# EAGLE design UCSD_QuadCopter_Rev1 (EAGLE 7.1.0)
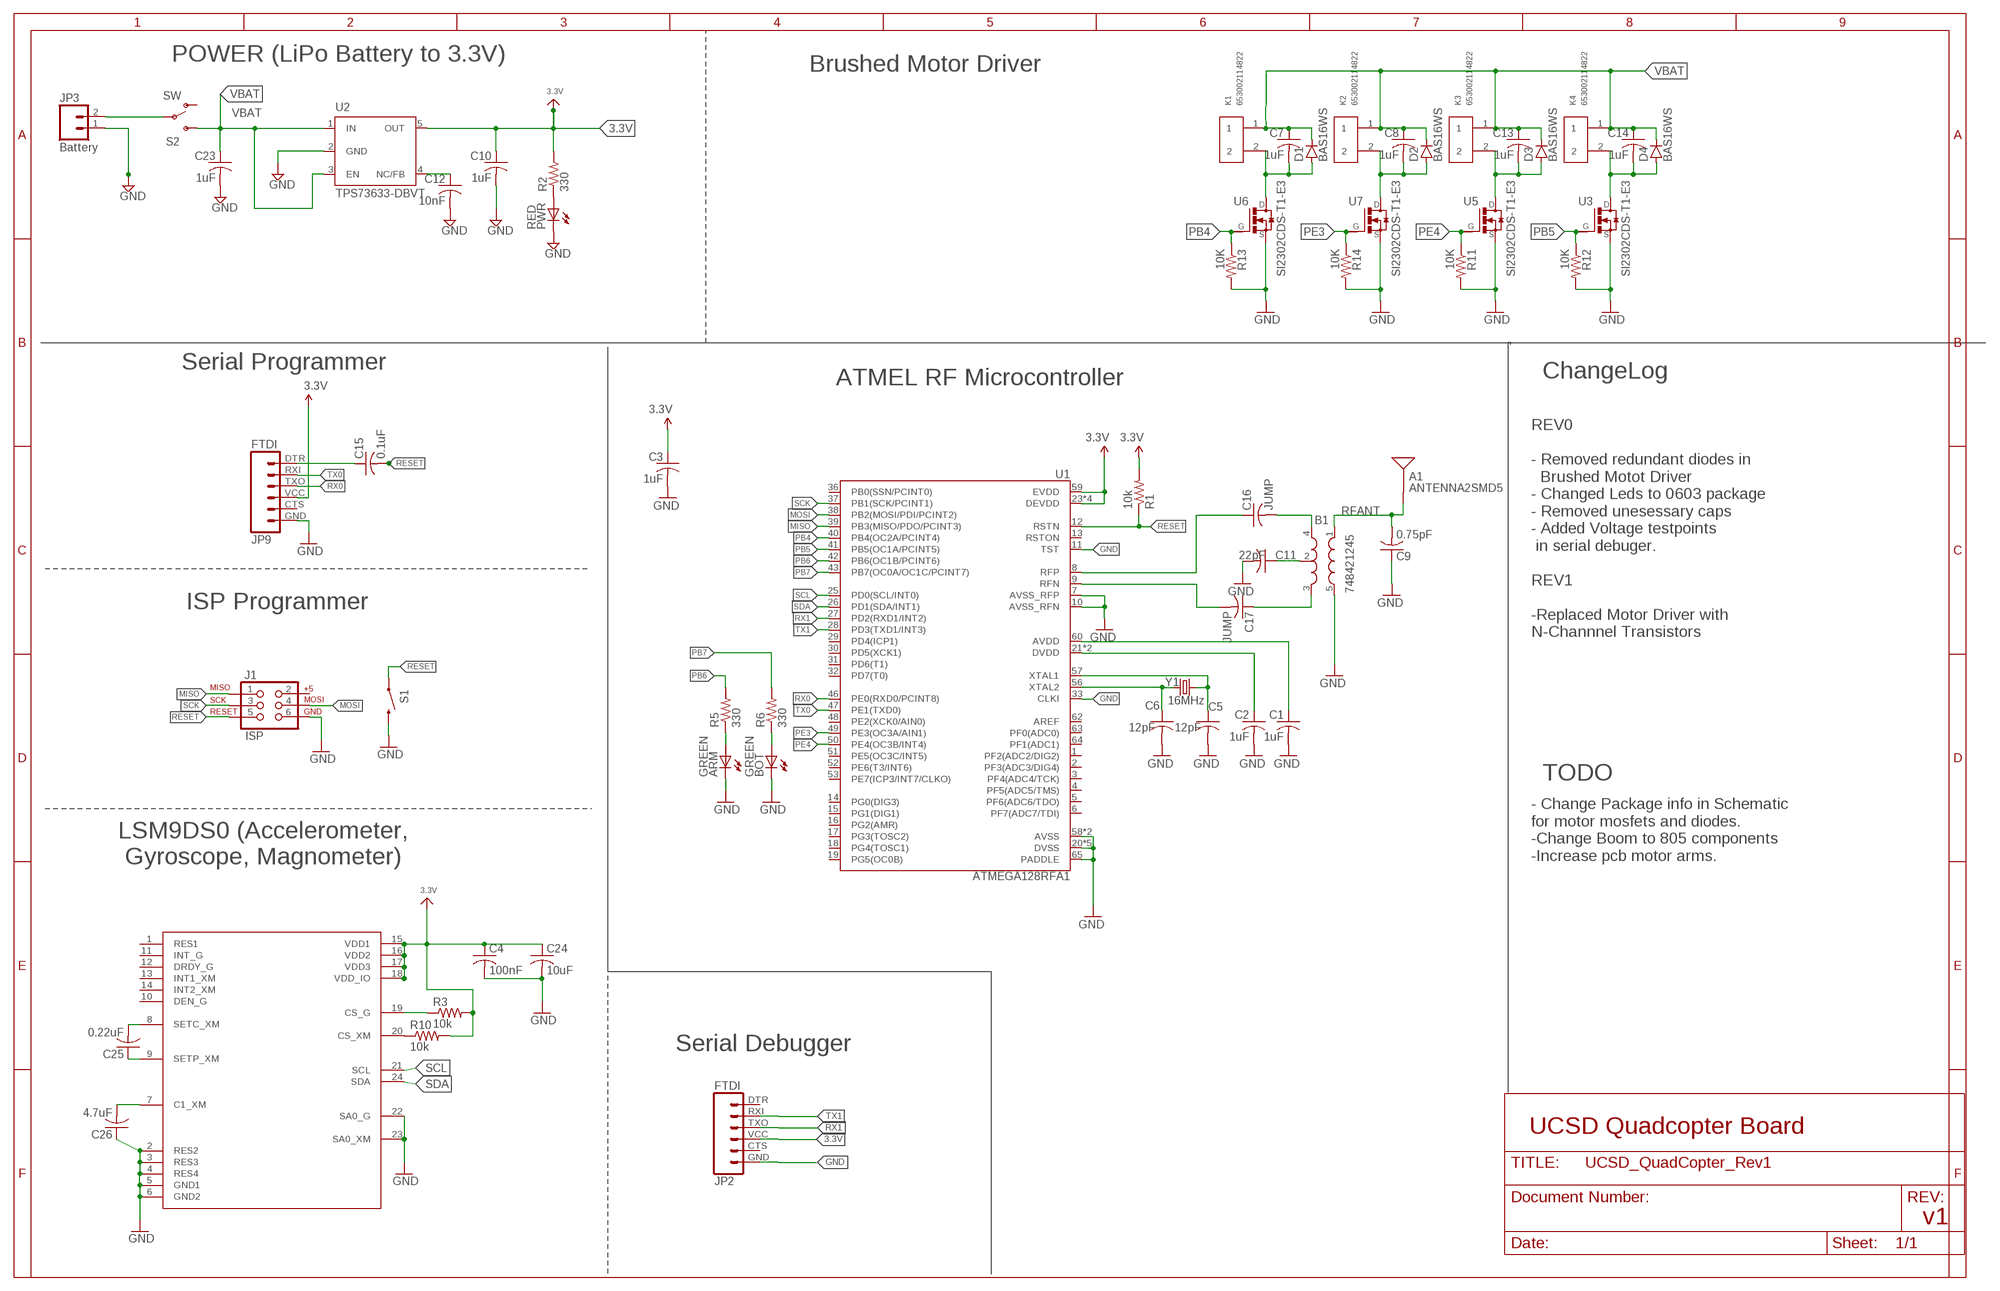
[diagram p0: schematic, sheet 1]

## Parts
A1  ANTENNA2SMD5  [ANTENNA-CHIP5]
ARM  GREEN  LEDCHIP-LED0805  [CHIP-LED0805]
B1  748421245  BALUN0805  [BALUN]
BOT  GREEN  LEDCHIP-LED0805  [CHIP-LED0805]
C1  1uF  C-USC0805  [C0805]
C2  1uF  C-USC0805  [C0805]
C3  1uF  C-USC0805  [C0805]
C4  100nF  C-USC0805  [C0805]
C5  12pF  C-USC0805  [C0805]
C6  12pF  C-USC0805  [C0805]
C7  1uF  C-USC0805  [C0805]
C8  1uF  C-USC0805  [C0805]
C9  0.75pF  C-USC0805  [C0805]
C10  1uF  C-USC0805  [C0805]
C11  22pF  C-USC0805  [C0805]
C12  10nF  C-USC0805  [C0805]
C13  1uF  C-USC0805  [C0805]
C14  1uF  C-USC0805  [C0805]
C15  0.1uF  C-USC0805  [C0805]
C16  JUMP  C-USC0805  [C0805]
C17  JUMP  C-USC0805  [C0805]
C23  1uF  C-USC0805  [C0805]
C24  10uF  C-USC0805  [C0805]
C25  0.22uF  C-USC0805  [C0805]
C26  4.7uF  C-USC0805  [C0805]
D1  BAS16WS  [SOD323_ST]
D2  BAS16WS  [SOD323_ST]
D3  BAS16WS  [SOD323_ST]
D4  BAS16WS  [SOD323_ST]
J1  ISP  AVR_SPI_PRG_6NS  [2X3-NS]
JP2  FTDI  FTDI_BASICPTH  [FTDI_BASIC]
JP3  Battery  M02PTH  [1X02]
JP9  FTDI  FTDI_BASICPTH  [FTDI_BASIC]
K1  653002114822  [653002114822]
K2  653002114822  [653002114822]
K3  653002114822  [653002114822]
K4  653002114822  [653002114822]
PWR  RED  LEDCHIP-LED0805  [CHIP-LED0805]
R1  10k  R-US_R0805  [R0805]
R2  330  R-US_R0805  [R0805]
R3  10k  R-US_R0805  [R0805]
R5  330  R-US_R0805  [R0805]
R6  330  R-US_R0805  [R0805]
R10  10k  R-US_R0805  [R0805]
R11  10K  R-US_R0805  [R0805]
R12  10K  R-US_R0805  [R0805]
R13  10K  R-US_R0805  [R0805]
R14  10K  R-US_R0805  [R0805]
S1  SWITCH-MOMENTARY-2SMD  [TACTILE_SWITCH_SMD]
S2  SW  SWITCH-SPDTPTH  [SWITCH-SPDT]
U1  ATMEGA128RFA1  [QFN-64]
U2  TPS73633-DBVT  [SOT23-DBV]
U3  SI2302CDS-T1-E3  [SOT95P237X112-3N]
U4  LSM9DS0  [LGA-24]
U5  SI2302CDS-T1-E3  [SOT95P237X112-3N]
U6  SI2302CDS-T1-E3  [SOT95P237X112-3N]
U7  SI2302CDS-T1-E3  [SOT95P237X112-3N]
Y1  16MHz  CRYSTAL5X3  [CRYSTAL-SMD-5X3]

## Nets
3.3V: C3.1 C4.1 C10.1 C24.1 JP2.VCC JP9.VCC R1.2 R2.2 R3.2 R10.2 U1.23(DEVDD) U1.34(DEVDD) U1.44(DEVDD) U1.54(DEVDD) U1.59(EVDD) U2.5(OUT) U4.15(VDD1) U4.16(VDD2) U4.17(VDD3) U4.18(VDD_IO)
AVDD: C1.1 U1.60(AVDD)
DTR: C15.1 JP9.DTR
DVDD: C2.1 U1.21(DVDD) U1.22(DVDD)
GND: ARM.C B1.5(GND) BOT.C C1.2 C2.2 C3.2 C4.2 C5.2 C6.2 C9.1 C10.2 C11.2 C12.2 C23.2 C24.2 C26.1 J1.6 JP2.GND JP3.1 JP9.GND PWR.C R11.2 R12.2 R13.2 R14.2 S1.3 U1.7(AVSS_RFP) U1.10(AVSS_RFN) U1.11(TST) U1.20(DVSS) U1.24(DVSS) U1.33(CLKI) U1.35(DVSS) U1.45(DVSS) U1.55(DVSS) U1.58(AVSS) U1.61(AVSS) U1.65(PADDLE) U2.2(GND) U3.2(S) U4.2(RES2) U4.3(RES3) U4.4(RES4) U4.5(GND1) U4.6(GND2) U4.22(SA0_G) U4.23(SA0_XM) U5.2(S) U6.2(S) U7.2(S)
MISO: J1.1 U1.39(PB3(MISO/PDO/PCINT3))
MOSI: J1.4 U1.38(PB2(MOSI/PDI/PCINT2))
N$1: C12.1 U2.4(NC/FB)
N$2: PWR.A R2.1
N$3: C5.1 U1.57(XTAL1) Y1.3
N$4: C6.1 U1.56(XTAL2) Y1.1
N$7: B1.2(GND) C11.1
N$8: ARM.A R5.1
N$10: B1.4(OUT1) C16.2
N$11: B1.3(OUT2) C17.1
N$13: BOT.A R6.1
N$15: JP3.2 S2.2(P)
N$20: C26.2 U4.7(C1_XM)
N$21: C25.2 U4.8(SETC_XM)
N$22: C25.1 U4.9(SETP_XM)
N$23: R3.1 U4.19(CS_G)
N$24: R10.1 U4.20(CS_XM)
N$29: C7.2 D1.A K1.2 U6.3(D)
N$30: C8.2 D2.A K2.2 U7.3(D)
N$31: C13.2 D3.A K3.2 U5.3(D)
N$32: C14.2 D4.A K4.2 U3.3(D)
PB4: R13.1 U1.40(PB4(OC2A/PCINT4)) U6.1(G)
PB5: R12.1 U1.41(PB5(OC1A/PCINT5)) U3.1(G)
PB6: R5.2 U1.42(PB6(OC1B/PCINT6))
PB7: R6.2 U1.43(PB7(OC0A/OC1C/PCINT7))
PE3: R14.1 U1.49(PE3(OC3A/AIN1)) U7.1(G)
PE4: R11.1 U1.50(PE4(OC3B/INT4)) U5.1(G)
RESET: C15.2 J1.5 R1.1 S1.1 U1.12(RSTN)
RFANT [RFSIG]: A1.FEED(SIGNAL) B1.1(IN) C9.2
RFN: C17.2 U1.9(RFN)
RFP: C16.1 U1.8(RFP)
RX0: JP9.TXO U1.46(PE0(RXD0/PCINT8))
RX1: JP2.TXO U1.27(PD2(RXD1/INT2))
SCK: J1.3 U1.37(PB1(SCK/PCINT1))
SCL: U1.25(PD0(SCL/INT0)) U4.21(SCL)
SDA: U1.26(PD1(SDA/INT1)) U4.24(SDA)
TX0: JP9.RXI U1.47(PE1(TXD0))
TX1: JP2.RXI U1.28(PD3(TXD1/INT3))
VBAT: C7.1 C8.1 C13.1 C14.1 C23.1 D1.C D2.C D3.C D4.C K1.1 K2.1 K3.1 K4.1 S2.3(S) U2.1(IN) U2.3(EN)
Unconnected: J1.2 JP2.CTS JP2.DTR JP9.CTS S2.1(O) U1.1(PF2(ADC2/DIG2)) U1.2(PF3(ADC3/DIG4)) U1.3(PF4(ADC4/TCK)) U1.4(PF5(ADC5/TMS)) U1.5(PF6(ADC6/TDO)) U1.6(PF7(ADC7/TDI)) U1.13(RSTON) U1.14(PG0(DIG3)) U1.15(PG1(DIG1)) U1.16(PG2(AMR)) U1.17(PG3(TOSC2)) U1.18(PG4(TOSC1)) U1.19(PG5(OC0B)) U1.29(PD4(ICP1)) U1.30(PD5(XCK1)) U1.31(PD6(T1)) U1.32(PD7(T0)) U1.36(PB0(SSN/PCINT0)) U1.48(PE2(XCK0/AIN0)) U1.51(PE5(OC3C/INT5)) U1.52(PE6(T3/INT6)) U1.53(PE7(ICP3/INT7/CLKO)) U1.62(AREF) U1.63(PF0(ADC0)) U1.64(PF1(ADC1)) U4.1(RES1) U4.10(DEN_G) U4.11(INT_G) U4.12(DRDY_G) U4.13(INT1_XM) U4.14(INT2_XM)

## Notes on the sheet
- POWER (LiPo Battery to 3.3V)
- Brushed Motor Driver
- Serial Programmer
- ATMEL RF Microcontroller | ChangeLog
- ISP Programmer
- REV0
  
  - Removed redundant diodes in 
    Brushed Motot Driver
  - Changed Leds to 0603 package
  - Removed unesessary caps
  - Added Voltage testpoints
   in serial debuger.
  
  REV1
  
  -Replaced Motor Driver with 
  N-Channnel Transistors
- TODO
- LSM9DS0 (Accelerometer,
   Gyroscope, Magnometer)
- - Change Package info in Schematic
  for motor mosfets and diodes.
  -Change Boom to 805 components
  -Increase pcb motor arms.
- Serial Debugger
- UCSD Quadcopter Board
- v1

## Library data of the parts
A1 = SparkFun-RF:ANTENNA2: Chip antenna Single endded antenna. Common with smaller chip antennas. CHIP4 package is the GPS Chip Antenna SKU: GPS-08418. CHIP5 package is 2.4GHz chip antenna SKU: WRL-00144.
ARM BOT PWR = led:LED: LED OSRAM: - CHIPLED LG R971, LG N971, LY N971, LG Q971, LY Q971, LO R971, LY R971 LH N974, LH R974 LS Q976, LO Q976, LY Q976 LO Q996 - Hyper CHIPLED LW Q18S LB Q993, LB Q99A, LB R99A - SideLED LS A670, LO A670, LY A670, LG A670, LP A670 LB A673, LV A673, LT A673, LW A673 LH A674 LY A675 LS A676, LA A676, LO A676, LY A676, LW A676 LS A679, LY A679, LG A679 - Hyper Micro SIDELED® LS Y876, LA Y876, LO Y876, LY Y876 LT Y87S - SmartLED LW L88C, LW L88S LB L89C, LB L89S, LG L890 LS L89K, LO L89K, LY L89K LS L896, LA L896, LO L896, LY L896 - TOPLED LS T670, LO T670, LY T670, LG T670, LP T670 LSG T670, LSP T670, LSY T670, LOP T670, LYG T670 LG T671, LOG T671, LSG T671 LB T673, LV T673, LT T673, LW T673 LH T674 LS T676, LA T676, LO T676, LY T676, LB T676, LH T676, LSB T676, LW T676 LB T67C, LV T67C, LT T67C, LS T67K, LO T67K, LY T67K, LW E67C LS E67B, LA E67B, LO E67B, LY E67B, LB E67C, LV E67C, LT E67C LW T67C LS T679, LY T679, LG T679 LS T770, LO T770, LY T770, LG T770, LP T770 LB T773, LV T773, LT T773, LW T773 LH T774 LS E675, LA E675, LY E675, LS T675 LS T776, LA T776, LO T776, LY T776, LB T776 LHGB T686 LT T68C, LB T68C - Hyper Mini TOPLED® LB M676 - Mini TOPLED Santana® LG M470 LS M47K, LO M47K, LY M47K Source: http://www.osram.convergy.de LUXEON: - LUMILED® LXK2-PW12-R00, LXK2-PW12-S00, LXK2-PW14-U00, LXK2-PW14-V00 LXK2-PM12-R00, LXK2-PM12-S00, LXK2-PM14-U00 LXK2-PE12-Q00, LXK2-PE12-R00, LXK2-PE12-S00, LXK2-PE14-T00, LXK2-PE14-U00 LXK2-PB12-K00, LXK2-PB12-L00, LXK2-PB12-M00, LXK2-PB14-N00, LXK2-PB14-P00, LXK2-PB14-Q00 LXK2-PR12-L00, LXK2-PR12-M00, LXK2-PR14-Q00, LXK2-PR14-R00 LXK2-PD12-Q00, LXK2-PD12-R00, LXK2-PD12-S00 LXK2-PH12-R00, LXK2-PH12-S00 LXK2-PL12-P00, LXK2-PL12-Q00, LXK2-PL12-R00 Source: www.luxeon.com KINGBRIGHT: KA-3528ASYC Source: www.kingbright.com
B1 = SparkFun-RF:BALUN: 0805 footprint balun- Ember 351/357
C1-C3 C5-C17 C23 = resistor:C-US: CAPACITOR, American symbol
C4 C24-C26 = rcl:C-US: CAPACITOR, American symbol
D1-D4 = Controller:BAS16WS: Small Signal Fast Switching Diode Source: Vishay Semiconductor, BAS16WS.pdf
J1 = Controller:AVR_SPI_PRG_6: AVR ISP 6 Pin This is the reduced ISP connector for AVR programming. Common on Arduino. This footprint will take up less PCB space and can be used with a 10-pin to 6-pin adapter such as SKU: BOB-08508
JP2 JP9 = SparkFun-Connectors:FTDI_BASIC: FTDI Basic header with labels
JP3 = SparkFun:M02: Header 2 Standard 2-pin 0.1" header. Use with straight break away headers (SKU : PRT-00116), right angle break away headers (PRT-00553), swiss pins (PRT-00743), machine pins (PRT-00117), and female headers (PRT-00115). Molex polarized connector foot print use with SKU : PRT-08233 with associated crimp pins and housings.
K1-K4 = Wuerth_Elektronik_eiCan_Wire_to_Board_Connectors:653002114822: WR-WTB 1.25mm Male Vertical Shrouded Header, 2 Pins=>Code : Con_WTB_1.25_PCB_THT_653002114822 <http://katalog.we-online.de/media/thumbs2/eican/thb_Con_WTB_1.25_PCB_THT_6530xx114822_pf2.jpg> Details see: http://katalog.we-online.de/en/em/653_0xx_114_822 Created 2014-06-06, Karrer Zheng 2014 (C) Würth Elektronik; OC_FARNELL: unknown
R1-R3 R5 R6 R10-R14 = resistor:R-US_: RESISTOR, American symbol
S1 = SparkFun-Electromechanical:SWITCH-MOMENTARY-2: Various NO switches- pushbuttons, reed, etc
S2 = Controller:SWITCH-SPDT: SPDT Switch Simple slide switch, Spark Fun Electronics SKU : COM-00102 DPDT SMT slide switch, AYZ0202, SWCH-08179; PROD_ID: SWCH-08261
U1 = Controller:ATMEGA128RFA1: ATmega128RFA1 8-bit AVR Microcontroller with Low Power 2.4GHz Transceiver for ZigBee and IEEE 802.15.4
U2 = Power:TPS73633-DBVT
U3 U5-U7 = Controller:SI2302CDS-T1-E3: N-Channel 30 V (D-S) MOSFET; MPN: SI2302CDS-T1-E3; OC_FARNELL: 2056680; OC_NEWARK: 64T4057; PACKAGE: SOT-23-3; SUPPLIER: VISHAY SILICONIX
U4 = Controller:LSM9DS0: IMU
Y1 = SparkFun-FreqCtrl:CRYSTAL: Various standard crystals. Proven footprints. Spark Fun Electronics SKU : COM-00534

## Net classes
1 RFSIG: width 0.457 mm, clearance 0.205 mm to class 0, clearance 0.205 mm

## Board
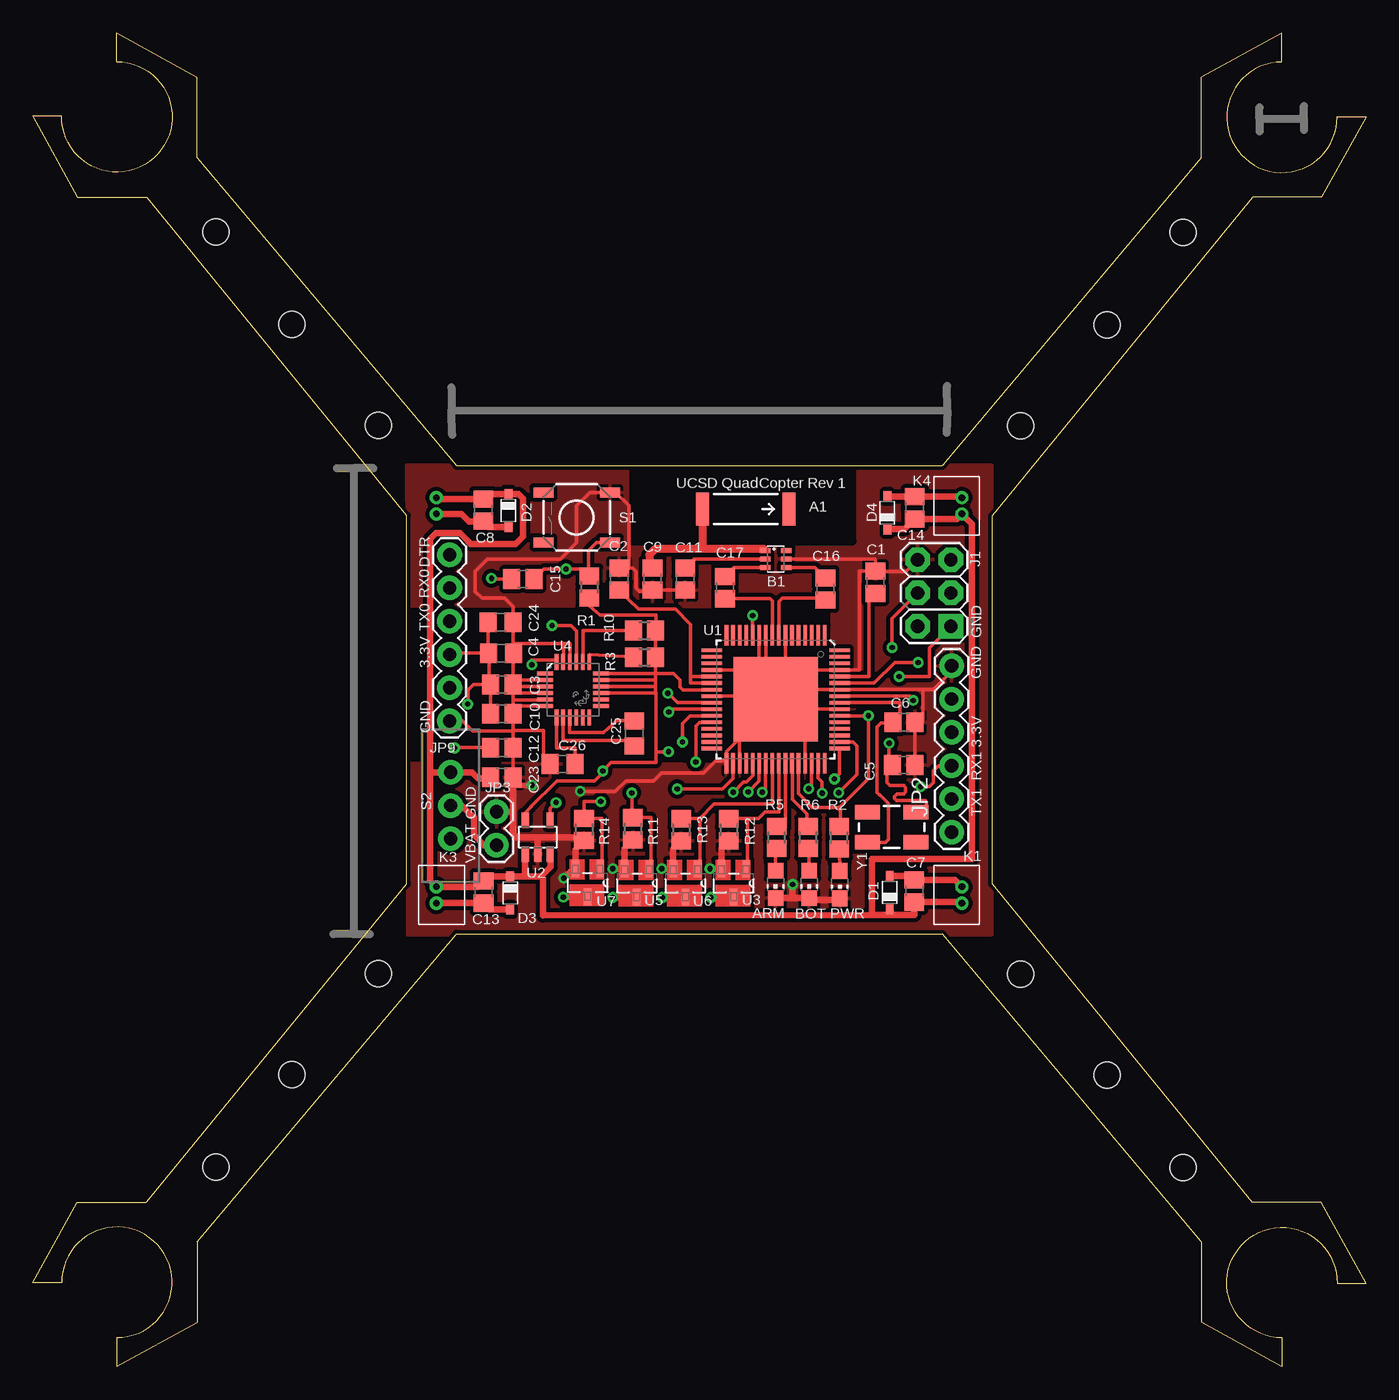
[diagram p1: board, top side]
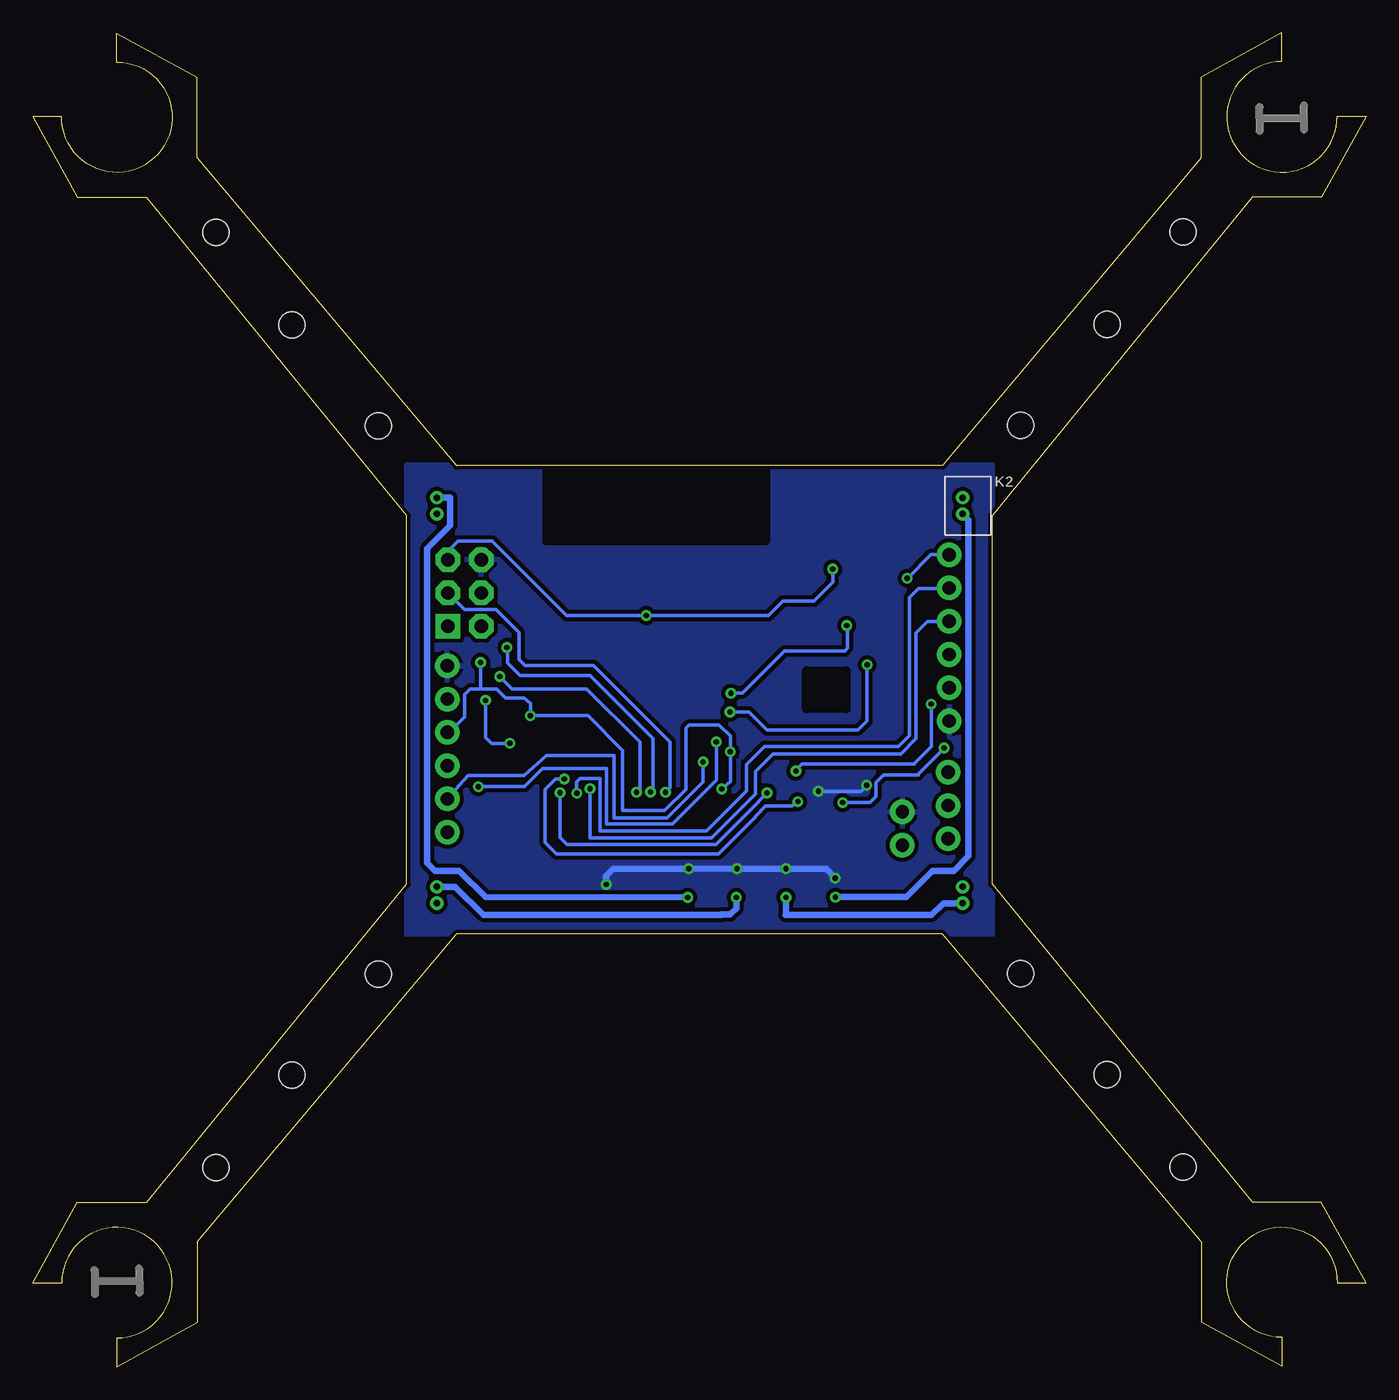
[diagram p2: board, bottom side, seen from below]

Size 101.8 x 101.85 mm. Coordinates in mm from the lower left corner, seen from the top.
Outline: 32.37,33.05 69.44,33.05
Outline: 28.55,36.86 28.55,65 8.69,89.28 8.66,89.31 3.4,89.31 0,95.48 2.21,95.48 arc271 6.43,99.64 6.43,101.85 12.57,98.48 12.57,92.33 32.36,68.82
Outline: 32.38,68.8 69.44,68.8 89.23,92.3 89.23,98.45 95.38,101.83 95.38,99.62 arc271 99.59,95.45 101.8,95.45 98.4,89.28 93.14,89.28 93.12,89.26 73.25,64.97 73.25,36.86 93.12,12.57 93.14,12.55 98.4,12.55 101.8,6.38 99.59,6.38 arc271 95.38,2.21 95.38,0 89.23,3.38 89.23,9.53 69.44,33.03
Outline: 32.36,33.06 12.57,9.55 12.57,3.4 6.43,0.03 6.43,2.24 arc271 2.21,6.4 0,6.4 3.4,12.57 8.66,12.57 8.69,12.6 28.55,36.88
Copper layers (1*16): Top 0.035559375mm / dielectric 1.501140625mm / Bottom 0.035559375mm
Design rules "4pcb-33board *": minimum track width 8mil, minimum drill 15mil, track to track 6mil, track to pad 6mil, pad to pad 6mil, via to via 6mil, smd to smd 6mil, copper to edge 10mil, drill to drill 10mil, minimum pad ring 10mil, minimum via ring 8mil, stop-mask expansion 4mil, vias tented up to drill 0mil, thermal gap 10mil
Holes 2 mm at 87.83,86.61 75.41,71.86 82.02,79.55 87.83,15.21 75.41,29.97 82.02,22.28 13.97,86.64 26.39,71.88 19.79,79.58 13.97,15.24 26.39,30 19.79,22.3
tRestrict: area 45.8,63 to 50.4,68.6; area 51.9,63 to 57,68.6; area 58.3,63 to 62.6,68.6; area 50.4,67.1 to 51.9,68.6; area 57,67.1 to 58.3,68.6; area 57,63 to 58.3,64
bRestrict: area 50.4,63 to 51.9,67.1; area 45.8,63 to 50.4,68.6; area 50.4,67.1 to 51.9,68.6; area 51.9,63 to 57,68.6; area 57,67.1 to 58.3,68.6; area 58.3,63 to 62.6,68.6; area 57,63 to 58.3,64; area 39.7,50.2 to 42.7,53.2

### Footprints (pad centres in the part's own frame; a part is rotated, then mirrored left to right if it is on the bottom)
ANTENNA-CHIP5 = smd 1.016 x 2.54: FEED -3.302,0; NC 3.302,0
CHIP-LED0805 = smd 1.2 x 1.2: A 0,-1.05; C 0,1.05
BALUN = smd 0.35 x 0.8: 1 -0.65,-0.8; 2 0,-0.8; 3 0.65,-0.8; 4 0.65,0.8; 5 0,0.8; 6 -0.65,0.8
C0805 = smd 1.3 x 1.5: 1 -0.85,0; 2 0.85,0
C0805' = smd 1.3 x 1.5: 1 -0.95,0; 2 0.95,0
SOD323_ST = smd 0.8 x 0.6: A 1.25,0; C -1.25,0
2X3-NS = drill 1.016 pad 1.88 square: 1 -2.54,-1.27 | drill 1.016 pad 1.88 octagon: 2 -2.54,1.27; 3 0,-1.27; 4 0,1.27; 5 2.54,-1.27; 6 2.54,1.27
FTDI_BASIC = drill 1.016 pad 1.88: CTS 10.16,0; DTR 0,0; GND 12.7,0; RXI 2.54,0; TXO 5.08,0; VCC 7.62,0
1X02 = drill 1.016 pad 1.88: 1 0,0; 2 2.54,0
653002114822 = drill 0.5: 1 0.625,0; 2 -0.625,0
R0805 = smd 1.3 x 1.5: 1 -0.85,0; 2 0.85,0
TACTILE_SWITCH_SMD = smd 1.524 x 0.762: 1 -2.54,1.905; 2 2.54,1.905; 3 -2.54,-1.905; 4 2.54,-1.905
SWITCH-SPDT = drill 1.016 pad 1.88: 1 0,2.54; 2 0,0; 3 0,-2.54
QFN-64 = smd 1.562 x 0.28: 1 -4.881,3.75; 2 -4.881,3.25; 3 -4.881,2.75; 4 -4.881,2.25; 5 -4.881,1.75; 6 -4.881,1.25; 7 -4.881,0.75; 8 -4.881,0.25; 9 -4.881,-0.25; 10 -4.881,-0.75; 11 -4.881,-1.25; 12 -4.881,-1.75; 13 -4.881,-2.25; 14 -4.881,-2.75; 15 -4.881,-3.25; 16 -4.881,-3.75; 33 4.881,-3.75; 34 4.881,-3.25; 35 4.881,-2.75; 36 4.881,-2.25; 37 4.881,-1.75; 38 4.881,-1.25; 39 4.881,-0.75; 40 4.881,-0.25; 41 4.881,0.25; 42 4.881,0.75; 43 4.881,1.25; 44 4.881,1.75; 45 4.881,2.25; 46 4.881,2.75; 47 4.881,3.25; 48 4.881,3.75 | smd 0.28 x 1.562: 17 -3.75,-4.881; 18 -3.25,-4.881; 19 -2.75,-4.881; 20 -2.25,-4.881; 21 -1.75,-4.881; 22 -1.25,-4.881; 23 -0.75,-4.881; 24 -0.25,-4.881; 25 0.25,-4.881; 26 0.75,-4.881; 27 1.25,-4.881; 28 1.75,-4.881; 29 2.25,-4.881; 30 2.75,-4.881; 31 3.25,-4.881; 32 3.75,-4.881; 49 3.75,4.881; 50 3.25,4.881; 51 2.75,4.881; 52 2.25,4.881; 53 1.75,4.881; 54 1.25,4.881; 55 0.75,4.881; 56 0.25,4.881; 57 -0.25,4.881; 58 -0.75,4.881; 59 -1.25,4.881; 60 -1.75,4.881; 61 -2.25,4.881; 62 -2.75,4.881; 63 -3.25,4.881; 64 -3.75,4.881 | smd 6.452 x 6.452: 65 0,0
SOT23-DBV = smd 0.55 x 1.2: 1 -0.95,-1.3; 2 0,-1.3; 3 0.95,-1.3; 4 0.95,1.3; 5 -0.95,1.3
SOT95P237X112-3N = smd 1.321 x 0.559: 1 -1.092,0.94; 2 -1.092,-0.94; 3 1.092,0
LGA-24 = smd 1.208 x 0.29: 1 -2.129,1.25; 2 -2.129,0.75; 3 -2.129,0.25; 4 -2.129,-0.25; 5 -2.129,-0.75; 6 -2.129,-1.25; 13 2.129,-1.25; 14 2.129,-0.75; 15 2.129,-0.25; 16 2.129,0.25; 17 2.129,0.75; 18 2.129,1.25 | smd 0.29 x 1.208: 7 -1.25,-2.129; 8 -0.75,-2.129; 9 -0.25,-2.129; 10 0.25,-2.129; 11 0.75,-2.129; 12 1.25,-2.129; 19 1.25,2.129; 20 0.75,2.129; 21 0.25,2.129; 22 -0.25,2.129; 23 -0.75,2.129; 24 -1.25,2.129
CRYSTAL-SMD-5X3 = smd 1.9 x 1.1: 1 -1.85,-1.15; 2 1.85,-1.15; 3 1.85,1.15; 4 -1.85,1.15

### Placement (x,y rotation side)
A1  54.43,65.48 0 top
ARM  56.72,36.83 180 top
B1  56.72,61.67 270 top
BOT  59.28,36.83 180 top
C1  64.34,59.89 90 top
C2  44.78,60.15 90 top
C3  35.81,52.1 0 top
C4  100nF  [C0805']  35.76,54.48 0 top
C5  66.5,45.95 0 top
C6  66.52,49.2 0 top
C7  67.31,36.32 90 top
C8  34.39,65.41 270 top
C9  47.32,60.15 90 top
C10  200uF  [C0805]  35.81,49.86 0 top
C11  49.81,60.15 270 top
C12  35.81,47.27 0 top
C13  34.42,36.25 270 top
C14  67.34,65.58 90 top
C15  37.41,60.15 0 top
C16  60.53,59.39 90 top
C17  52.86,59.49 270 top
C23  100uF  [C0805]  35.81,45.01 0 top
C24  10uF  [C0805']  35.71,56.85 0 top
C25  0.22uF  [C0805']  45.92,48.36 270 top
C26  4.7uF  [C0805']  40.46,46.02 0 top
D1  65.43,36.22 90 top
D2  36.32,65.38 270 top
D3  36.45,36.17 270 top
D4  65.25,65.2 90 top
J1  68.83,59.08 90 top
JP2  70.15,40.82 90 top
JP3  35.41,42.37 270 top
JP9  31.83,62 270 top
K1  70.94,36.02 270 top
K2  30.81,65.74 90 bottom
K3  30.81,36.02 90 top
K4  70.94,65.74 270 top
PWR  61.62,36.8 180 top
R1  42.49,59.54 270 top
R2  61.57,40.39 90 top
R3  46.71,54.18 0 top
R5  56.79,40.41 90 top
R6  59.21,40.41 90 top
R10  46.71,56.21 0 top
R11  45.82,41.07 270 top
R12  53.14,41 270 top
R13  49.5,41 270 top
R14  42.09,41.02 270 top
S1  41.53,64.85 180 top
S2  31.9,42.85 180 top
U1  56.72,50.95 270 top
U2  38.56,40.44 0 top
U3  53.52,36.93 270 top
U4  41.25,51.69 0 top
U5  46.13,36.93 270 top
U6  49.83,36.93 270 top
U7  42.37,36.96 270 top
Y1  65.58,41.2 0 top

### Tracks (layer width: path | path; a pad name or v marks a point on that pad's centre or on a via)
3.3V  (via drill 0.41)
  Top 0.254: U1.34 53.47,46.25 53.47,44.93 52.65,44.12 v49.2,44.12 | 58.45,46.25 U1.44 58.47,46.25 58.45,46.23 | 58.45,46.36 58.45,46.23 | 42.42,59.22 R1.2 42.49,58.06 43.33,57.38 47.6,57.38 47.6,56.25 R10.2 R3.2 47.56,52.94 | 58.45,46.23 58.45,43.76 59.51,42.7 61.39,42.7 | 47.56,52.94 47.56,52.44 | 47.56,52.44 47.56,51.94 | 47.56,51.94 47.56,51.44 | U4.18 47.56,52.94 | U4.17 47.56,52.44 | U4.16 47.56,51.94 | U4.15 47.56,51.44 | 47.56,52.94 48.94,52.94 49.43,52.45 49.43,51.89 49.63,51.69 51.82,51.69 U1.23 | C24.1 34.76,54.58 C4.1 | C4.1 34.86,52.09 C3.1 | C10.1 C3.1 | C3.1 33.65,52.1 33.22,51.66 33.22,50.62 v33.2,50.6 | 61.39,42.7 61.67,42.42 61.67,41.34 R2.2 | 47.56,51.44 47.57,51.44 47.57,46.89 | 47.57,46.89 47.61,46.93 48.55,46.93 v48.55,46.96 | 47.57,46.89 47.57,46.13 44.17,46.13 v43.54,45.49 | C4.1 31.93,54.48 JP9.VCC | U1.54 63.9,49.7 v63.8,49.71 63.8,44.91 61.59,42.7 61.39,42.7 | U1.59 64.24,52.2 65.81,53.77 v67.61,53.77 | 43.48,45.49 v43.54,45.49 | v43.54,45.49 43.54,45.36 42.9,44.73 40.03,44.73 38.02,42.72 38.05,42.72 37.67,42.34 37.64,41.77 U2.5
  Bottom 0.254: v49.2,44.12 48.55,44.7 v48.55,46.96 48.55,48.14 49.4,49 51.71,49 51.94,48.77 51.94,44.09 53.57,42.47 56.77,42.47 56.77,47.07 59.41,49.71 v63.8,49.71 63.8,50.62 64.29,51.05 65.68,51.08 66.37,51.77 67.54,51.77 67.61,51.84 | v33.2,50.6 33.2,47.35 34.49,46.05 34.49,46.02 43.05,46.02 43.54,45.54 v43.54,45.49 | 67.72,53.75 v67.61,53.77 67.61,51.84 | JP2.VCC 69.88,48.72 69.72,48.72 68.83,49.61 68.83,51.33 68.4,51.77 67.69,51.77 67.61,51.84
AVDD
  Top 0.254: 64.41,58.97 C1.1 63.83,58.54 63.83,52.7 U1.60
DTR  (via drill 0.41)
  Top 0.254: C15.1 35.08,60.15 v35.03,60.2
  Bottom 0.254: JP9.DTR 33.22,62 v35.03,60.2
DVDD
  Top 0.254: C2.1 44.78,59.28 46.25,57.86 49.07,57.86 50.22,56.67 50.22,52.7 | U1.22 50.22,52.2 50.22,52.7 | U1.21 50.22,52.7
GND  (via drill 0.41)
  Top 0.254: U1.10 55.97,51.5 | 55.97,51.5 U1.65 | 55.97,51.5 55.47,51 54.13,51 | U1.7 57.47,53 | 57.47,53 55.97,51.5 | U1.10 55.97,53.81 55.82,53.66 | 55.82,53.66 55.45,53.29 55.45,55.23 U1.11 | U1.10 55.97,53.28 56.46,52.78 54.18,52.78 53.92,53.04 | U1.10 55.97,54.29 | U1.10 55.97,50.76 | 53.89,53 53.92,53.04 | 53.98,47.98 54.18,48.21 54.18,50.95 54.13,51 | U1.45 58.97,50.17 | 58.97,50.17 58.97,51.29 | 58.97,51.29 58.75,51.51 55.82,51.51 55.82,53.66 | U1.35 53.98,46.25 53.98,47.98 | 44.81,61.02 C2.2 45.49,61 | 45.49,61 45.81,61 46.08,60.73 46.08,59.46 46.33,59.21 47.23,59.21 C9.1 C11.2 | B1.5 64.29,61.67 64.34,61.62 C1.2 | C1.2 64.35,60.73 66.67,60.73 J1.6 | 39.14,50.44 U4.6 39.37,50.44 36.66,50.44 | U4.23 40.51,53.56 40.51,55.22 | U4.22 41.02,53.56 41.02,55.22 40.51,55.22 | C5.2 67.35,48.69 | 67.35,48.69 67.35,49.17 C6.2 | 39.35,51.92 U4.3 36.66,51.94 C3.2 | 39.36,50.95 U4.5 39.37,50.93 36.66,50.93 | 36.68,56.86 36.68,58.04 36.04,58.67 34.32,58.67 33.78,59.21 33.78,60.73 34.72,61.67 40.28,61.67 41.53,62.92 41.53,65.74 42.54,66.75 S1.3 44.5,66.75 45.52,65.74 45.52,61.02 45.49,61 | 36.68,56.86 C24.2 | 36.68,56.86 36.68,55.22 | 36.68,55.22 36.68,54.5 36.7,54.5 C4.2 36.66,54.48 C3.2 | 36.66,51.99 C3.2 | U4.4 39.37,51.46 36.66,51.46 | 40.51,55.22 36.68,55.22 | 36.66,52.45 C3.2 | 36.94,44.83 C23.2 C12.2 36.66,48.67 | 36.66,50.93 36.66,50.44 | 36.66,50.44 36.66,49.73 C10.2 36.66,48.67 | 36.66,48.67 36.74,48.59 39.01,48.59 39.01,46.61 C26.1 | 36.66,48.67 36.54,48.54 33.58,48.54 32.82,49.3 JP9.GND | 70.15,53.44 JP2.GND 69.77,53.14 69.77,52.71 68.78,51.71 67.94,51.71 | 53.98,47.98 52.97,46.97 U1.33 52.96,46.25 52.15,46.25 51.23,45.34 48.01,45.34 47.4,44.73 45.29,44.73 44.48,43.92 44.45,43.94 v41.81,43.94
  Top 0.254: U1.20 53.92,53.2 53.92,53.04 | U1.24 53.92,51.2 54.13,51 | 57.47,53 57.67,53.2 U1.61 63.12,53.2 63.12,60.74 C1.2 | 58.97,51.29 59.38,51.7 U1.58 61.61,51.71 67.94,51.71 | 67.94,51.71 67.97,51.69 67.97,49.32 67.35,48.69 | U1.55 59.01,50.2 58.97,50.17 | 36.66,52.43 C3.2 | 36.66,50.93 | 36.66,50.93 36.66,51.46 | 36.66,51.46 C3.2 | U4.2 36.66,52.44 C3.2
  Top 0.406: C23.2 36.68,45 36.68,44.5 36.78,44.4 v38.13,44.4 | R14.2 41.85,40.17 41.63,40.39 41.4,40.39 41.43,40.36 | 36.65,42.37 36.68,42.39
  Top 0.508: 36.68,44.5 36.68,42.39 36.68,40.69 36.96,40.41 38.46,40.41 | JP3.1 36.65,42.37 | 38.46,40.41 41.38,40.41 41.4,40.39 | U2.2 38.56,40.31 38.46,40.41 | v40.54,37.31 41.27,38.05 U7.2 41.43,39.51 R14.2 | v44.3,38.02 U5.2 45.19,39.59 R11.2 45.8,40.2 | v48.03,38.02 U6.2 48.89,39.54 R13.2 | v51.71,38.02 U3.2 52.58,39.59 R12.2 | PWR.C 61.42,35.65 59.41,35.65 BOT.C 58.14,35.78 | ARM.C 58.14,35.78 | v58.01,36.83 58.01,35.91 58.14,35.78
  Bottom 0.254: v38.13,44.4 38.58,43.94 v41.81,43.94
  Bottom 0.508: v40.54,37.31 40.54,37.34 41.2,38 44.27,38 v44.3,38.02 v48.03,38.02 48.18,38.05 v51.71,38.02 57.48,38.02 58.01,37.49 v58.01,36.83
  pour Bottom (isolate 0.305): 28.55,68.86 28.55,33.05 73.25,33.05 73.25,68.86
  pour Top (isolate 0.305): 28.63,58.06 61.01,58.01 61.06,46 38.2,46.05 28.63,46.05 28.63,32.97 73.23,32.97 73.23,68.86 28.55,68.86 28.55,68.66
MISO  (via drill 0.41)
  Top 0.254: U1.39 55.96,46.24 55.96,44.12 v55.7,43.87 | J1.1 68.68,55.12 68.45,54.89 68.45,52.71 v66.14,52.71
  Bottom 0.254: v55.7,43.87 55.45,44.12 55.45,47.7 59.51,51.77 65.2,51.77 v66.14,52.71
MOSI  (via drill 0.41)
  Top 0.254: J1.4 65.61,57.12 v65.61,54.91 | U1.38 55.47,44.72 v54.64,43.89
  Bottom 0.254: v54.64,43.89 54.43,44.09 54.43,47.96 59.26,52.78 64.59,52.78 65.56,53.75 65.56,54.86 v65.61,54.91
N$1  (via drill 0.41)
  Top 0.254: C12.1 32.23,47.27 v32.21,47.24 | U2.4 39.51,42.63 v39.95,43.08
  Bottom 0.254: v32.21,47.24 34.19,45.26 34.19,45.19 36.86,45.19 37.41,44.63 37.41,43.56 37.9,43.08 v39.95,43.08
N$2
  Top 0.254: 61.44,39.41 R2.1 61.59,39.51 PWR.A
N$3  (via drill 0.41)
  Top 0.254: Y1.3 67.9,42.35 68.22,42.72 68.22,43.13 68.15,43.26 65.94,43.26 65.79,43.41 65.79,43.56 65.96,43.74 66.5,43.74 66.65,43.89 66.65,44.25 66.52,44.37 65.43,44.37 65.2,44.6 65.2,45.69 65.46,45.95 C5.1 65.14,46.46 65.38,46.7 v65.38,47.6 | U1.57 66.93,51.2 v67.23,50.88
  Bottom 0.254: v67.23,50.88 67.23,48.06 66.78,47.6 v65.38,47.6
N$4
  Top 0.254: Y1.1 65.12,40.05 65.33,40.26 65.33,43 64.67,43.66 64.64,43.66 64.47,43.84 64.47,48.84 64.77,49.15 65.62,49.15 C6.1 66.19,49.72 66.19,50.7 U1.56
N$7
  Top 0.254: B1.2 50.48,61.67 C11.1
N$8
  Top 0.254: ARM.A 56.69,39.46 R5.1
N$10
  Top 0.254: 57.54,61 B1.4 59.74,61.02 C16.2
N$11
  Top 0.254: B1.3 53.54,61.02 C17.1
N$13
  Top 0.254: 59.11,39.46 R6.1 59.28,39.49 BOT.A
N$15
  Top 0.406: 33.45,42.14 33.48,42.14 | 35.38,39.8 JP3.2
  Top 0.508: S2.2 32.74,42.85 33.45,42.14 | 33.48,42.14 33.68,41.94 33.68,40.59 34.47,39.8 35.38,39.8
N$20
  Top 0.254: U4.7 39.98,49.81 39.98,47.24 41.41,47.24 C26.2
N$21
  Top 0.254: C25.2 | U4.8 40.49,49.81 40.49,47.83 45.51,47.83 C25.2 | C25.2
N$22
  Top 0.254: U4.9 41,48.41 43.58,48.41 44.6,49.33 45.91,49.33 C25.1 | 45.91,49.3 C25.1 | 45.92,48.84 C25.1
N$23
  Top 0.254: R3.1 42.5,54.38 U4.19
N$24
  Top 0.254: R10.1 42,56.21 U4.20
N$29  (via drill 0.41 pad 0.41)
  Top 0.406: 67.01,37.47 C7.2
  Top 0.508: U6.3 v48.08,35.84 | D1.A 67.01,37.47 | C7.2 70.41,37.17 K1.2
  Bottom 0.406: K1.2
  Bottom 0.508: K1.2 69.55,36.65 67.39,34.49 49.23,34.49 49.2,34.52 48.56,34.52 48.08,35 v48.08,35.84
N$30  (via drill 0.41 pad 0.41)
  Top 0.406: 34.82,64.13 C8.2
  Top 0.508: U7.3 v40.51,35.86 | D2.A 34.82,64.13 | K2.2 32.76,65.11 33.32,64.54 34.38,64.54 C8.2
  Bottom 0.508: v40.51,35.86 35.1,35.86 33.1,37.87 31.47,37.87 30.35,38.99 30.35,64.65 K2.2 30.83,65.13
N$31  (via drill 0.41 pad 0.41)
  Top 0.406: K3.2
  Top 0.508: U5.3 v44.3,35.84 | D3.A 34.89,34.92 C13.2 K3.2
  Bottom 0.406: 30.82,35.38 K3.2
  Bottom 0.508: 30.82,35.38 32.28,35.38 33.17,34.49 44.32,34.49 44.3,34.52 v44.3,35.84
N$32  (via drill 0.41 pad 0.41)
  Top 0.406: 67.32,66.45 C14.2 | 70.87,66.43 K4.2
  Top 0.508: U3.3 v51.79,35.84 | D4.A 67.32,66.45 | C14.2 70.87,66.43
  Bottom 0.406: 69.93,66.34 69.94,66.36
  Bottom 0.508: v51.79,35.84 67.23,35.86 69.24,37.87 71.07,37.87 71.68,38.48 71.7,62.46 69.93,64.24 69.93,66.34 | 69.94,66.36 K4.2
PB4
  Top 0.254: U1.40 56.47,42.96 56.46,42.95 52.03,42.95 50.93,41.85 | U6.1 50.93,38.02 50.93,41.85 | 50.93,41.85 R13.1
PB5
  Top 0.254: U1.41 56.97,42.36 56.95,42.34 55.91,42.34 55.42,41.86 54.56,41.86 54.56,41.85 | U3.1 54.56,38.05 54.56,41.85 | 54.56,41.85 R12.1
PB6
  Top 0.254: U1.42 57.48,46.24 57.48,41.17 57.43,41.15 56.91,41.15 R5.2 | 56.82,41.31 R5.2 | 56.85,41.31 R5.2
PB7
  Top 0.254: U1.43 57.99,46.23 57.99,43.31 59.11,42.19 59.11,41.36 R6.2
PE3  (via drill 0.41 pad 0.41)
  Top 0.254: U7.1 43.46,38.07 43.46,41.87 R14.1 42.09,43.15 v43.38,43.15 | U1.49 61.6,45.27 v61.21,44.88
  Bottom 0.254: v61.21,44.88 61.87,44.88 62.69,44.07 62.69,40.03 61.82,39.17 49.45,39.17 46.63,41.99 46.63,42.01 45.85,42.8 43.84,42.8 v43.38,43.15
PE4  (via drill 0.41 pad 0.41)
  Top 0.254: U5.1 47.22,38.02 47.22,41.92 R11.1 | 45.82,41.4 R11.1 | v45.75,43.82 45.75,41.44 R11.1 | U1.50 62.64,47.7 62.94,47.4 62.94,45.24 v61.54,43.84
  Bottom 0.254: v61.54,43.84 61.54,40.41 61.01,39.88 49.63,39.88 46.41,43.1 46.41,43.15 v45.75,43.82
RESET  (via drill 0.41)
  Top 0.254: v54.97,57.35 54.97,55.28 U1.12 | C15.2 39.03,60.91 v40.72,60.91 42.41,60.91 R1.1 42.44,60.44 42.44,62.33 43.05,62.94 S1.1
  Bottom 0.254: v40.72,60.91 40.72,59.92 42.16,58.47 44.53,58.47 45.64,57.35 v54.97,57.35 61.04,57.35 66.73,63.04 69.34,63.04 70.1,62.28 J1.5
RFANT
  Top 0.254: 55.81,62.43 55.92,62.43 B1.1
  Top 0.61: A1.FEED 51.13,62.43 | 55.81,62.43 51.13,62.43 | 51.13,62.43 47.52,62.43 47.09,62 47.09,61.02 C9.2
RFN
  Top 0.254: 56.46,55.25 U1.9 56.49,55.27 56.49,58.45 56.3,58.64 C17.2
RFP
  Top 0.254: U1.8 56.97,58.42 57.25,58.7 60.36,58.7 C16.1
RX0  (via drill 0.41)
  Top 0.254: U1.46 59.47,44.36 v59.26,44.15
  Bottom 0.254: v59.26,44.15 59.26,40.39 49.99,40.39 46.63,43.74 46.63,45.44 45.29,46.79 35.53,46.79 34.37,47.96 34.37,56.01 33.48,56.9 31.85,56.9 JP9.TXO
RX1  (via drill 0.41)
  Top 0.254: v67.79,44.3 68.45,44.3 68.78,44.6 68.78,45.52 69.14,45.87 70.13,45.87 JP2.TXO | v49.61,47.7 49.61,49.1 50.19,49.68 51.82,49.68 U1.27
  Bottom 0.254: v49.61,47.7 49.61,44.81 52.96,41.45 57.99,41.45 57.99,45.67 62.89,45.67 64.26,44.3 v67.79,44.3
SCK  (via drill 0.41)
  Top 0.254: U1.37 54.99,46.27 54.99,45.16 54.48,44.65 54.28,44.65 v53.49,43.87
  Bottom 0.254: J1.3 68.83,57.81 66.42,57.81 64.67,56.06 64.67,54 64.21,53.54 59,53.54 53.16,47.7 53.16,44.2 v53.49,43.87
SCL  (via drill 0.41)
  Top 0.254: U4.21 41.53,53.56 41.53,56.16 41.1,56.59 v39.65,56.59 | U1.25 49.22,50.7 v48.49,51.44
  Bottom 0.254: v39.65,56.59 39.6,56.54 39.6,54.86 39.8,54.66 44.4,54.66 47.62,51.44 v48.49,51.44
SDA  (via drill 0.41)
  Top 0.254: U1.26 48.78,50.2 v48.56,49.99 | v38.1,53.59 38.1,53.95 40,53.95 U4.24
  Bottom 0.254: v38.1,53.59 38.1,49.3 38.79,48.62 45.75,48.62 47.12,49.99 v48.56,49.99
TX0  (via drill 0.41)
  Top 0.254: U1.47 59.97,44.96 60.27,44.65 v60.27,43.79
  Bottom 0.254: v60.27,43.79 60.27,44.65 60.02,44.91 58.5,44.91 58.5,40.92 50.34,40.92 47.29,43.97 47.29,46 45.92,47.37 35.71,47.37 34.87,48.21 34.87,58.72 34.16,59.44 31.85,59.44 JP9.RXI
TX1  (via drill 0.41)
  Top 0.254: U1.28 50.9,49.2 50.62,48.92 v50.62,46.18
  Bottom 0.254: v50.62,46.18 50.62,44.65 53.37,41.91 57.4,41.91 57.4,46.69 62.56,46.69 64.29,45.14 68.55,45.14 JP2.RXI
VBAT
  Top 0.406: 34.43,66.29 C8.1 | 34.58,37.26 C13.1 | 34.79,44.93 C23.1 | 34.42,66.22 C8.1 | 65.46,34.49 D1.C | C7.1 67.34,35.47 | 36.45,37.26 D3.C 36.45,37.44 | 34.77,66.63 C8.1 | 36.34,66.65 D2.C | 33.27,62.99 33.27,62.97
  Top 0.508: C7.1 70.94,35.47 K1.1 | D4.C 66.55,63.95 C14.1 70.56,64.73 K4.1 71.7,64.35 71.7,38.76 64.08,38.76 64.08,34.49 | 64.08,34.49 65.46,34.49 | 67.34,35.47 67.34,34.49 65.58,34.49 D1.C | D3.C 34.42,37.42 C13.1 33.96,36.64 K3.1 30.35,37.1 30.35,45.39 | 64.08,34.49 38.96,34.47 38.96,37.29 38.81,37.44 | D2.C 34.77,66.63 | 36.34,66.65 37.08,66.65 37.44,66.29 37.44,63.4 36.86,62.81 33.43,62.81 33.27,62.97 | 33.27,62.99 32.61,63.65 30.78,63.65 30.3,63.17 30.35,63.17 30.35,45.39 | 34.79,44.93 34.01,44.93 33.55,45.39 S2.3 30.35,45.39 | 36.45,37.44 37.72,37.44 | 37.72,37.44 38.81,37.44 | 38.81,37.44 39.52,38.15 39.52,39.12 U2.3 | U2.1 37.61,37.55 37.72,37.44 | C8.1 30.92,66.26 K2.1

### Text on the board
tPlace: UCSD QuadCopter Rev 1 | DTR | RX0 | TX0 | GND | 3.3V | GND | GND | 3.3V | RX1 | GND | TX1 | VBAT
tDocu: 0.276 inch / 7.0104 mm | 1.4 inch / 35.56 mm | 3.930 inch / 99.822 mm | 1.41 inch / 35.81 mm | >Info / Board Name: UCSD QuadCopter / Part Number: 0 / Number of Layers: 2 / Dimension X= 3.930 inch / Dimension Y= 3.934 inch / Board Material Type: FR-4 / Solder Mask Color: Green / Silkscreen Color: White / Finish Plating: HASAL / Revision Number: 1 | 3.934 inch / 99.9236 mm
bDocu: 0.276 inch / 7.0104 mm | 0.276 inch / 7.0104 mm